# Altium schematic sheet analog_input.SchDoc: Test
size Letter; SheetNumber: 1; SheetTotal: 6; Project: USB Oscope; ENG_APP_DATE: --/--/--; DSN_APP_DATE: --/--/--; CHK_APP_DATE: --/--/--
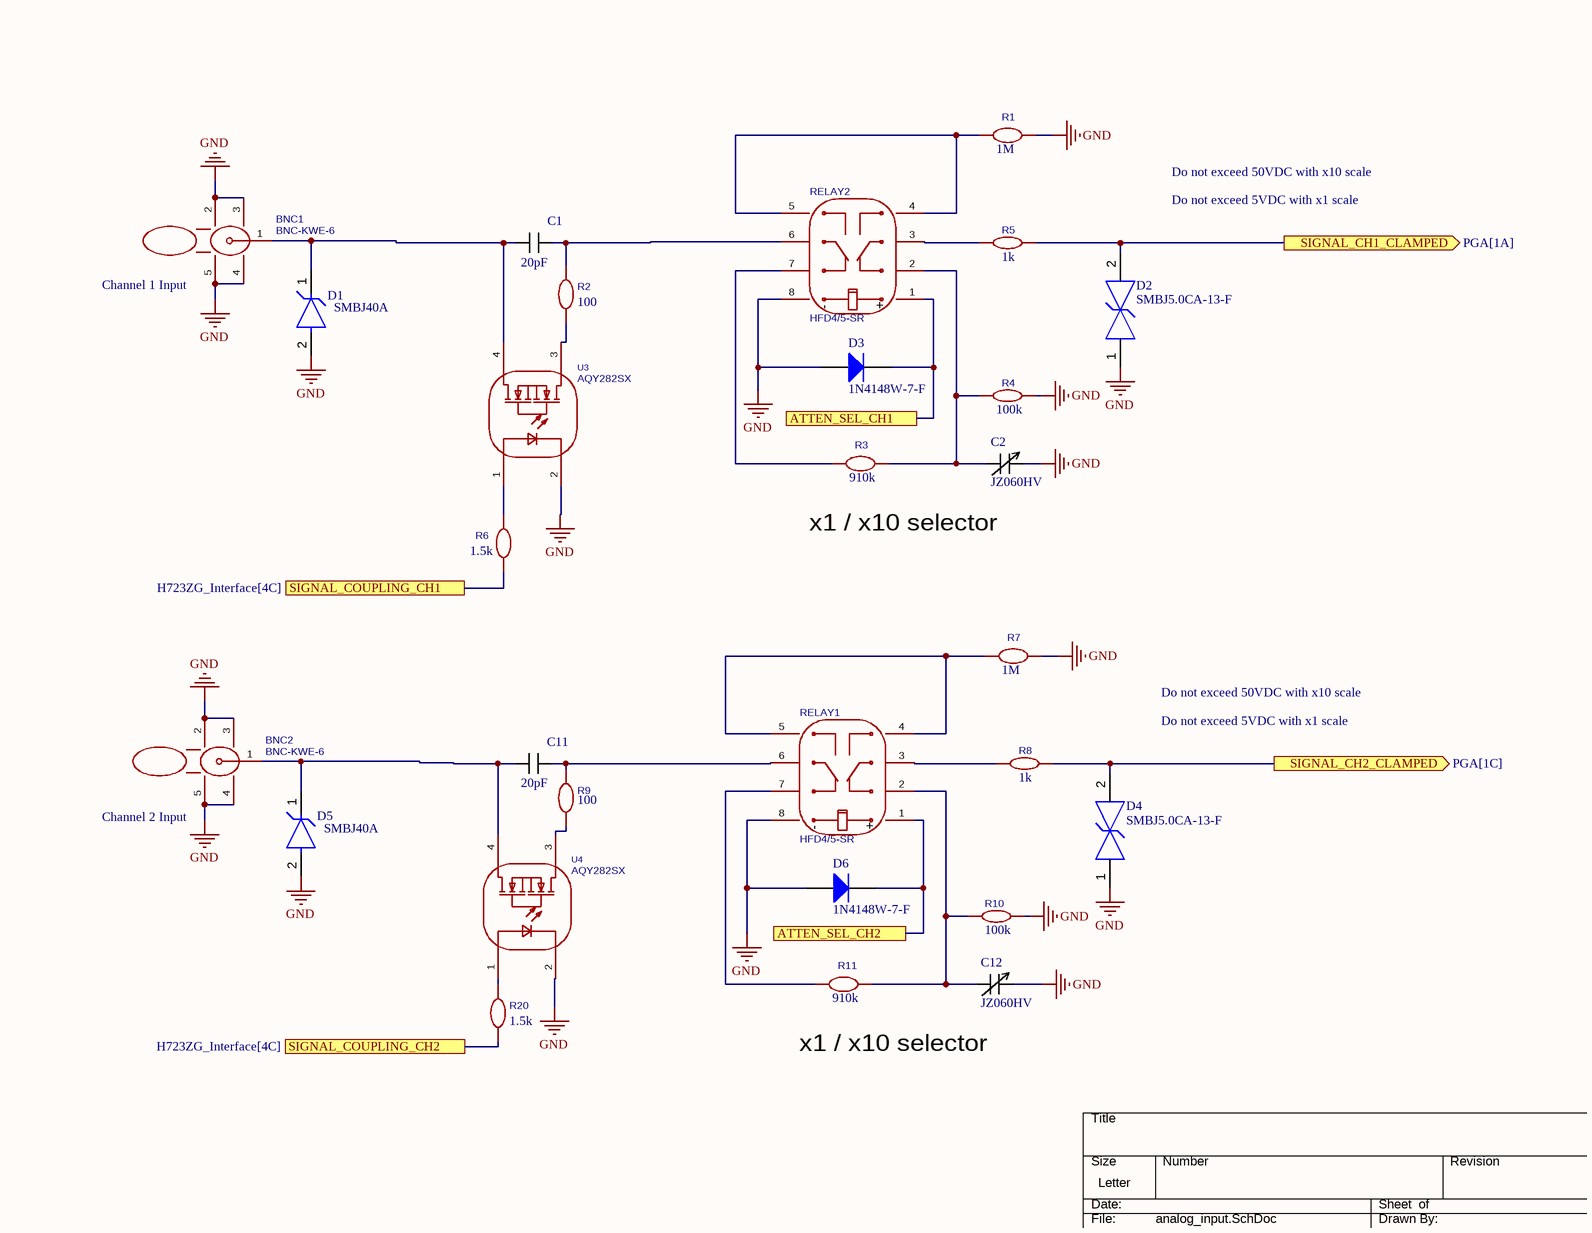
[diagram p0: analog_input.SchDoc]

## Parts
BNC1  BNC-KWE-6  [CONN-TH_BNC-KWE-6]
BNC2  BNC-KWE-6  [CONN-TH_BNC-KWE-6]
C1  value 20pF  [CAPCP2012X150N]  (hidden comment: TCC0805COG200J500BT)
C2  JZ060HV  [CAPCP4914X60N]
C11  value 20pF  [CAPCP2012X150N]  (hidden comment: Capacitor)
C12  JZ060HV  [CAPCP4914X60N]
D1  SMBJ40A  [FP-SMBJ-MFG]
D2  SMBJ5.0CA-13-F  [FP-SMB-CA-MFG]
D3  1N4148W-7-F  [DIOD-SOD123-2_V]
D4  SMBJ5.0CA-13-F  [FP-SMB-CA-MFG]
D5  SMBJ40A  [FP-SMBJ-MFG]
D6  1N4148W-7-F  [DIOD-SOD123-2_V]
R1  value 1M  [R0805]  (hidden comment: RT0805BRD0710K1L)
R2  value 100  [R0805]  (hidden comment: RT0805BRD0710K1L)
R3  value 910k  [R0805]  (hidden comment: RT0805BRD0710K1L)
R4  value 100k  [R0805]  (hidden comment: 0805W8F0000T5E_C17477)
R5  value 1k  [R0805]  (hidden comment: 0805W8F0000T5E_C17477)
R6  value 1.5k  [R0805]  (hidden comment: RT0805BRD0710K1L)
R7  value 1M  [R0805]  (hidden comment: RT0805BRD0710K1L)
R8  value 1k  [R0805]  (hidden comment: 0805W8F0000T5E_C17477)
R9  value 100  [R0805]  (hidden comment: RT0805BRD0710K1L)
R10  value 100k  [R0805]  (hidden comment: 0805W8F0000T5E_C17477)
R11  value 910k  [R0805]  (hidden comment: RT0805BRD0710K1L)
R20  value 1.5k  [R0805]  (hidden comment: RT0805BRD0710K1L)
RELAY1  HFD4/5-SR  [RELAY-SMD_HFD4-5-SR]
RELAY2  HFD4/5-SR  [RELAY-SMD_HFD4-5-SR]
U3  AQY282SX  [SOP-4_L4.3-W4.4-P2.54-LS7.0-BL]
U4  AQY282SX  [SOP-4_L4.3-W4.4-P2.54-LS7.0-BL]

## Ports
ATTEN_SEL_CH1 (see REF_VOLTAGE_RELAY_DRIVER[1C]), ATTEN_SEL_CH2 (see REF_VOLTAGE_RELAY_DRIVER[1D]), SIGNAL_CH1_CLAMPED (out, see PGA[1A]), SIGNAL_CH2_CLAMPED (out, see PGA[1C]), SIGNAL_COUPLING_CH1 (see H723ZG_Interface[4C]), SIGNAL_COUPLING_CH2 (see H723ZG_Interface[4C])

## Nets
GND: BNC1.2 BNC1.3 BNC1.4 BNC1.5 BNC2.2 BNC2.3 BNC2.4 BNC2.5 C2.2 C12.2 D1.2(A) D2.1 D3.1(A) D4.1 D5.2(A) D6.1(A) R1.1 R4.1 R7.1 R10.1 RELAY1.8 RELAY2.8 U3.2 U4.2
ATTEN_SEL_CH1: D3.2(K) RELAY2.1 ; port ATTEN_SEL_CH1
ATTEN_SEL_CH2: D6.2(K) RELAY1.1 ; port ATTEN_SEL_CH2
SIGNAL_CH1_CLAMPED: D2.2 R5.1 ; port SIGNAL_CH1_CLAMPED
SIGNAL_CH2_CLAMPED: D4.2 R8.1 ; port SIGNAL_CH2_CLAMPED
SIGNAL_COUPLING_CH1: R6.1 ; port SIGNAL_COUPLING_CH1
SIGNAL_COUPLING_CH2: R20.1 ; port SIGNAL_COUPLING_CH2
NetBNC1_1: BNC1.1 C1.1 D1.1(C) U3.4
NetBNC2_1: BNC2.1 C11.1 D5.1(C) U4.4
NetC1_2: C1.2 R2.2 RELAY2.6
NetC2_1: C2.1 R3.1 R4.2 RELAY2.2
NetC11_2: C11.2 R9.2 RELAY1.6
NetC12_1: C12.1 R10.2 R11.1 RELAY1.2
NetR1_2: R1.2 RELAY2.4 RELAY2.5
NetR2_1: R2.1 U3.3
NetR3_2: R3.2 RELAY2.7
NetR5_2: R5.2 RELAY2.3
NetR6_2: R6.2 U3.1
NetR7_2: R7.2 RELAY1.4 RELAY1.5
NetR8_2: R8.2 RELAY1.3
NetR9_1: R9.1 U4.3
NetR11_2: R11.2 RELAY1.7
NetR20_2: R20.2 U4.1

## Notes on the sheet
- Do not exceed 50VDC with x10 scale
- Do not exceed 5VDC with x1 scale
- (near BNC1) Channel 1 Input
- x1 / x10 selector
- (near BNC2) Channel 2 Input
- THIS DOCUMENT AND THE DATA DISCLOSED HEREIN OR
- HEREWITH IS THE PROPERTY OF ALTIUM LIMITED AND MAY
- DWG NO:
- REVISION
- REV:
- DESCRIPTION
- DATE
- APPROVED
- BE FREELY DISTRIBUTED IN WHOLE. NO RIGHTS ARE
- RESERVED OR EXPRESS OR IMPLIED WARANTEE GIVEN.
- ENG:
- APPROVALS
- PROJECT
- DSN:
- CHK:
- REFERENCE DOCUMENTS
- PROJECT REVISION:
- TITLE
- DOCUMENT REVISION:
- DESIGN ITEM:
- BOM:
- FAB DWG:
- PCB DWG:
- ASSY DWG:
- SCALE:
- A3
- SIZE
- CAGE CODE
- FILE NAME
- DWG NO.
- SHEET
- OF
- REV
- (in symbol CMP-006-000000-2) -; +

## Library data of the parts
BNC1 BNC2 = CMP-004-000000-4: Connector Type:Board Side Interface:Inner Bore Number of Ports:1 Interface Length/Height:12mm Frequency:6GHz RF Series:BNC Impedance:50Ω Style:Bent tip; Manufacturer: cntitle(中戈泰斗); Number of Ports: 1; Value: 6GHz; 3D Model Transform: 531.016,1338.97378,0,0,0,0,0,-470.511,-149.606; Impedance: 50Ω; 3D Model: 1ee7285c1b8f4c589de2df097266f005聨0819f05c4eef4c71ace90d822a990e87; AddInBom: yes; RF Series: BNC; Interface Length/Height: 12mm; Source: P1.SCHLIB; Symbol: BNC-KWE-6; LCSC Part Name: 内孔 BNC 弯头; Style: Bent tip; Interface: Inner Bore; Connector Type: Board Side; FootprintName: CONN-TH_BNC-KWE-6; Datasheet: https://item.szlcsc.com/datasheet/BNC-KWE-6/21743971.html; Device: BNC-KWE-6; ModelName: CONN-TH_BNC-KWE-6; Supplier Footprint: 弯插; ConvertToPcb: yes; JLCPCB Part Class: Extended Part; Design Item ID: BNC-KWE-6; Manufacturer Part Number: BNC-KWE-6; Supplier Part Number: C20415789
C1 = CMP-00003-4: Mlcc 20PF ±5% C0G(NP0) 50V 0805; Manufacturer: CCTC; Supplier Part Number: C5375851; Supplier: JLCPCB; Manufacturer Part Number: TCC0805COG200J500BT
C2 C12 = CMP-00011-9: Variable Capacitor, 350V, 2pF Min, 6pF Max, Vertical Adjuster, Surface Mount; Voltage Rating (DC): 125V; Case/Package: 1813; Max Operating Temperature: 85°C; Min Operating Temperature: -40°C; Mounting Technology: Surface Mount; Height: 1.45mm; Width: 3.2mm; RoHS: Compliant; REACH SVHC: Yes; Lifecycle Status: Production; Length: 4.5mm
C11 = CMP-00003-4: Mlcc 20PF ±5% C0G(NP0) 50V 0805; Manufacturer: CCTC; Manufacturer Part Number: TCC0805COG200J500BT; Supplier Part Number: C5375851; Supplier: JLCPCB
D1 D5 = CMP-08607-000120-1: TVS DIODE 40VWM 64.5VC DO214AA; Peak Pulse Power: 600W; Min Breakdown Voltage: 44.4V; Number of Unidirectional Channels: 1; Voltage Rating (DC): 40V; Max Reverse Leakage Current: 1uA; Peak Pulse Current: 9.3A; Element Configuration: Single; Direction: Unidirectional; Max Breakdown Voltage: 49.1V; Power Line Protection: No; Test Current: 1mA; Clamping Voltage-Max: 64.5V; Diode Type: ZENER; Max Power Dissipation: 5W; Reverse Breakdown Voltage: 44.4V; Packaging: Tape and Reel; Width: 3.94mm; Package Quantity: 3000; Resistor Type: Zener; Lead Free: Lead Free; Case/Package: DO-214AA; RoHS Compliant: Yes; Series: SMBJ; Max Surge Current: 9.3A; Termination: SMD/SMT; Number of Pins: 2; Length: 4.57mm; Max Operating Temperature: 150°C; Polarity: Unidirectional; Breakdown Voltage: 44.4V; Height: 2.237mm; Mount: Surface Mount; Power Dissipation: 600W; Number of Channels: 1; Operating Supply Voltage: 40V; Clamping Voltage: 64.5V; Number of Elements: 1; Min Operating Temperature: -55°C; Reverse Standoff Voltage: 40V; Leakage Current: 1uA
D2 D4 = CMP-12828-000012-1: TVS DIODE 5V 9.2V SMB; Manufacturer: Diodes Inc; Peak Pulse Power: 600W; Direction: Bidirectional; Max Junction Temp: +150°C; Number Of Channels: 1; Peak Pulse Current: 65.2A; Breakdown Voltage: 6.4V; Standoff Height: 0.05mm; Device Class L2: TVS Diodes; Temperature: -55°C to +150°C; Digikey Description: TVS DIODE 5V 9.2V SMB; Manufacturer Part Number: SMBJ5.0CA-13-F; Octopart: https://octopart.com/smbj5.0ca-13-f-diodes+inc.-13025192; Mouser Description: TVS Diodes - Transient Voltage Suppressors 600W 5.0V; Temperature Range Low: -55°C; Reverse Standoff Voltage: 5V; Category: Diode; Lead Free: Yes; Device Class L3: unset; Footprint Url: https://www.diodes.com/assets/Package-Files/SMB.pdf; Clamping Voltage: 9.2V; Package: SMB-CA; Height: 2.5mm; Temperature Range High: +150°C; ComponentLink2Description: Datasheet; ComponentLink2URL: https://www.diodes.com/assets/Datasheets/ds19002.pdf; Automotive: No; Device Class L1: Circuit Protection; RoHS: TRUE
D3 D6 = CMP-2000-04932-2: Fast Switching Diode, 100 V, 0.15 A, -65 to 150 degC, 2-Pin?SOD123, RoHS, Tape and Reel; Manufacturer: Diodes Inc; Recovery Time: 4ns; Unit Weight: 0.000353oz; Max Surge Current: 2A; Peak Reverse Voltage: 100V; Ir - Reverse Current: 1uA; Vf - Forward Voltage: 1.25V; Configuration: Single; If - Forward Current: 0.15A; Product Category: Diodes-GeneralPurpose,Power,Switching; Operating Temperature Range: -65Cto+150C; Packaging: Reel; Manufacturer URL: http://www.diodes.com/; Maximum Operating Temperature: +150C; Height: 1.25mm; Minimum Operating Temperature: -65C; Product: SwitchingDiodes; Package URL: http://www.diodes.com/datasheets/ds18004.pdf; Type: SwitchingDiode; Package Reference: SOD123-2; Width: 1.7mm; Datasheet URL: http://www.farnell.com/datasheets/1915529.pdf; Datasheet Version: Rev. 24-2, 10/2013; Series: 1N4148; Factory Pack Quantity: 3000; Length: 2.85mm; RoHS: True; Mounting Style: SMD/SMT; Package / Case: SOD-123
R1 R7 = CMP-016-000007-1: Type:Thick Film Resistor Resistance:1MΩ Tolerance:±1% Tolerance:±1% Power(Watts):125mW Voltage-Supply(Max):150V Temperature Coefficient:±100ppm/℃ Temperature Coefficient:±100ppm/℃ Operating Temperature:-55℃~+155℃ Operating Temperature:-55℃~+155℃; Manufacturer: FOJAN(富捷); AddInBom: yes; Device: FRC0805F1004TS; ModelId: b83c7c5430874b8eb2319a65d9433429聨0819f05c4eef4c71ace90d822a990e87; ModelName: R0805_L2.0-W1.3-H0.6; ModelTransform: 78.74,51.181,0,0,0,0,0,-0.0005,0; Power(Watts): 125mW; Tolerance: 1%; Voltage-Supply(Max): 150V; ConvertToPcb: yes; Design Item ID: FRC0805F1004TS; FootprintName: R0805; JLCPCB Part Class: Extended Part; LCSC Part Name: 1MΩ ±1% 125mW 厚膜电阻; Operating Temperature: -55℃~+155℃; Source: P1.SCHLIB; Supplier Footprint: 0805; Symbol: FRC0805F1004TS; Temperature Coefficient: ±100ppm/℃; Type: Thick Film Resistor; Manufacturer Part Number: FRC0805F1004TS; Supplier Part Number: C2933280
R2 R9 = CMP-016-000006-1: Type:Thick Film Resistor Resistance:100Ω Tolerance:±1% Tolerance:±1% Power(Watts):125mW Voltage-Supply(Max):150V Temperature Coefficient:±100ppm/℃ Temperature Coefficient:±100ppm/℃ Operating Temperature:-55℃~+155℃ Operating Temperature:-55℃~+155℃; Manufacturer: FOJAN(富捷); AddInBom: yes; Device: FRC0805F1000TS; ModelId: b83c7c5430874b8eb2319a65d9433429聨0819f05c4eef4c71ace90d822a990e87; ModelName: R0805_L2.0-W1.3-H0.6; ModelTransform: 78.74,51.181,0,0,0,0,0,-0.0005,0; Power(Watts): 125mW; Tolerance: 1%; Voltage-Supply(Max): 150V; ConvertToPcb: yes; Datasheet: https://item.szlcsc.com/datasheet/FRC0805F1000TS/3180731.html; Design Item ID: FRC0805F1000TS; FootprintName: R0805; JLCPCB Part Class: Extended Part; LCSC Part Name: 100Ω ±1% 125mW 厚膜电阻; Operating Temperature: -55℃~+155℃; Source: P1.SCHLIB; Supplier Footprint: 0805; Symbol: FRC0805F1000TS; Temperature Coefficient: ±100ppm/℃; Type: Thick Film Resistor; Manufacturer Part Number: FRC0805F1000TS; Supplier Part Number: C2907218
R3 R11 = CMP-016-000015-1: Type:Thick Film Resistor Resistance:910kΩ Tolerance:±1% Tolerance:±1% Power(Watts):125mW Voltage-Supply(Max):150V Temperature Coefficient:±100ppm/℃ Temperature Coefficient:±100ppm/℃ Operating Temperature:-55℃~+155℃ Operating Temperature:-55℃~+155℃; Manufacturer: FOJAN(富捷); AddInBom: yes; Device: FRC0805F9103TS; ModelId: b83c7c5430874b8eb2319a65d9433429聨0819f05c4eef4c71ace90d822a990e87; ModelName: R0805_L2.0-W1.3-H0.6; ModelTransform: 78.74,51.181,0,0,0,0,0,-0.0005,0; Power(Watts): 125mW; Tolerance: 1%; Voltage-Supply(Max): 150V; ConvertToPcb: yes; Design Item ID: FRC0805F9103TS; FootprintName: R0805; JLCPCB Part Class: Extended Part; LCSC Part Name: 910kΩ ±1% 125mW 厚膜电阻; Operating Temperature: -55℃~+155℃; Source: P1.SCHLIB; Supplier Footprint: 0805; Symbol: FRC0805F9103TS; Temperature Coefficient: ±100ppm/℃; Type: Thick Film Resistor; Manufacturer Part Number: FRC0805F9103TS; Supplier Part Number: C2999461
R4 R10 = CMP-016-000003-1: Type:Thick Film Resistor Resistance:100kΩ Tolerance:±1% Tolerance:±1% Power(Watts):125mW Voltage-Supply(Max):150V Temperature Coefficient:±100ppm/℃ Temperature Coefficient:±100ppm/℃ Operating Temperature:-55℃~+155℃ Operating Temperature:-55℃~+155℃; Manufacturer: UNI-ROYAL(厚声); AddInBom: yes; Device: 0805W8F1003T5E; ModelId: b83c7c5430874b8eb2319a65d9433429聨0819f05c4eef4c71ace90d822a990e87; ModelName: R0805_L2.0-W1.3-H0.6; ModelTransform: 78.74,51.181,0,0,0,0,0,-0.0005,0; Power(Watts): 125mW; Symbol: 0805W8F1003T5E_C149504; Tolerance: 1%; Voltage-Supply(Max): 150V; ConvertToPcb: yes; Datasheet: https://item.szlcsc.com/datasheet/0805W8F1003T5E/160838.html; Design Item ID: 0805W8F1003T5E; FootprintName: R0805; JLCPCB Part Class: Basic Part; LCSC Part Name: 100kΩ ±1% 125mW 厚膜电阻; Operating Temperature: -55℃~+155℃; Source: P1.SCHLIB; Supplier Footprint: 0805; Temperature Coefficient: ±100ppm/℃; Type: Thick Film Resistor; Manufacturer Part Number: 0805W8F1003T5E; Supplier Part Number: C149504
R5 R8 = CMP-016-000001-1: Type:Thick Film Resistors Resistance:1kΩ Tolerance:±1% Tolerance:±1% Power(Watts): Overload Voltage (Max): Temperature Coefficient:±100ppm/℃ Temperature Coefficient:±100ppm/℃ Operating Temperature Range:-55℃~+155℃ Operating Temperature Range:-55℃~+155℃; Manufacturer: UNI-ROYAL(厚声); AddInBom: yes; Device: 0805W8F1001T5E; ModelId: b83c7c5430874b8eb2319a65d9433429聨0819f05c4eef4c71ace90d822a990e87; ModelName: R0805_L2.0-W1.3-H0.6; ModelTransform: 78.74,51.181,0,0,0,0,0,-0.0005,0; Tolerance: 1%; ConvertToPcb: yes; Datasheet: https://atta.szlcsc.com/upload/public/pdf/source/20200306/C422600_1E6D84923E4A46A82E41ADD87F860B5C.pdf; Design Item ID: 0805W8F1001T5E; FootprintName: R0805; JLCPCB Part Class: Basic Part; LCSC Part Name: 1kΩ ±1% 125mW 厚膜电阻; Operating Temperature Range: -55℃~+155℃; Source: P1.SCHLIB; Supplier Footprint: 0805; Symbol: 0805W8F1001T5E; Temperature Coefficient: ±100ppm/℃; Type: Thick Film Resistors; Manufacturer Part Number: 0805W8F1001T5E; Supplier Part Number: C17513
R6 R20 = CMP-016-000009-1: Type:Thick Film Resistor Resistance:1.5kΩ Tolerance:±1% Tolerance:±1% Power(Watts):125mW Voltage-Supply(Max):150V Temperature Coefficient:±100ppm/℃ Temperature Coefficient:±100ppm/℃ Operating Temperature:-55℃~+155℃ Operating Temperature:-55℃~+155℃; Manufacturer: FOJAN(富捷); AddInBom: yes; Device: FRC0805F1501TS; ModelId: b83c7c5430874b8eb2319a65d9433429聨0819f05c4eef4c71ace90d822a990e87; ModelName: R0805_L2.0-W1.3-H0.6; ModelTransform: 78.74,51.181,0,0,0,0,0,-0.0005,0; Power(Watts): 125mW; Tolerance: 1%; Voltage-Supply(Max): 150V; ConvertToPcb: yes; Design Item ID: FRC0805F1501TS; FootprintName: R0805; JLCPCB Part Class: Extended Part; LCSC Part Name: 1.5kΩ ±1% 125mW 厚膜电阻; Operating Temperature: -55℃~+155℃; Source: P1.SCHLIB; Supplier Footprint: 0805; Symbol: FRC0805F1501TS; Temperature Coefficient: ±100ppm/℃; Type: Thick Film Resistor; Manufacturer Part Number: FRC0805F1501TS; Supplier Part Number: C2907216
RELAY1 RELAY2 = CMP-006-000000-2: Coil Voltage:5V Contact Form:2 Form C: 2C (DPDT-CO) Number of Pins:8 Contact Rating:1A@30VDC；300mA@125VAC Switching Voltage(Max):250V@AC；220V@DC Contact Material:AgNi + Gold plated Coil Rated Power:140mW Coil Resistance:178Ω Switching Current(Max):2A Oper; Manufacturer: HF(宏发); Release Time: 3ms; Coil Voltage: 5V; Coil Type: Polarized-Single Coil; AddInBom: yes; ModelName: RELAY-SMD_L10.0-W6.5-H5.7-LS7.5-P2.2; ModelTransform: 393.7,307.086,0,0,0,0,-0.005,0,0; ModelId: abc4320b17a04819849f22b1ebcd3fe7聨0819f05c4eef4c71ace90d822a990e87; Switching Current(Max): 2A; Coil Resistance: 178Ω; Coil Rated Power: 140mW; Contact Resistance: 100mΩ; Contact Rating: 1A@30VDC；300mA@125VAC; Symbol: HFD4/5-S; JLCPCB Part Class: Extended Part; Operating Temperature: -40℃~+85℃; ConvertToPcb: yes; FootprintName: RELAY-SMD_HFD4-5-SR; Supplier Footprint: SMD,10x6.5mm; Device: HFD4/5-SR; Switching Voltage(Max): 250V@AC；220V@DC; Contact Form: 2 Form C: 2C (DPDT-CO); Datasheet: https://item.szlcsc.com/datasheet/HFD4%252F5-SR/65466.html; Contact Material: AgNi + Gold plated; Design Item ID: HFD4/5-SR; Number of Pins: 8; LCSC Part Name: 超小型5V继电器 双刀双掷; Source: P1.SCHLIB; Operate Time: 3ms; Manufacturer Part Number: HFD4/5-SR; Supplier Part Number: C64399
U3 U4 = CMP-006-000003-2: Contact Form:SPST-NO(1 Form A) Load Current:500mA Load Voltage:60V Load Voltage:60V Voltage - Forward(Vf):1.25V Forward Current(If):50mA RDS(on):850mΩ Isolation Voltage(Vrms):1.5kV Turn-on time:900us Turn-off time:500us Input Type:AC,DC Operating Temperat; Manufacturer: PANASONIC(松下); Insulation Resistance: 1000MΩ; Load Voltage: 60V; Turn-on time: 900us; RDS(on): 850mΩ; Forward Current(If): 50mA; Isolation Voltage(Vrms): 1.5kV; Total Power Dissipation(Pd): 350mW; ModelName: SOP-4_L4.4-W4.6-H2.1-LS7.0-P2.54; ConvertToPcb: yes; Voltage - Forward(Vf): 1.25V; Turn-off time: 500us; Input Type: AC,DC; ModelId: 43a8e8732de74b24a167faf554c5dad4聨0819f05c4eef4c71ace90d822a990e87; ModelTransform: 173.228,283.69762,0,0,0,0,0,0.005,0; Load Current: 500mA; Datasheet: https://item.szlcsc.com/datasheet/AQY282SX/246604.html; Source: P1.SCHLIB; Symbol: AQY282SX; FootprintName: SOP-4_L4.3-W4.4-P2.54-LS7.0-BL; Design Item ID: AQY282SX; Contact Form: SPST-NO(1 Form A); Operating Temperature: -40℃~+85℃; Device: AQY282SX; LCSC Part Name: 1 Form A(SPSTNO) 负载AC,DC 负载电压60V; AddInBom: yes; JLCPCB Part Class: Extended Part; Supplier Footprint: SOP-4-2.54mm; Manufacturer Part Number: AQY282SX; Supplier Part Number: C250827